# Altium schematic sheet Sunfish_ECU_BulkCaps_RevA.SchDoc
size A4
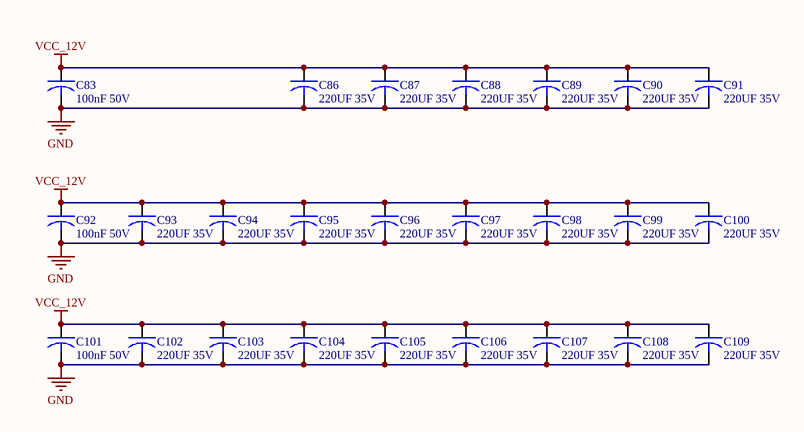
[diagram p0: Sunfish_ECU_BulkCaps_RevA.SchDoc]

## Parts
C83  100nF 50V  [0603]
C86  220UF 35V  [RB.15/.32]
C87  220UF 35V  [RB.15/.32]
C88  220UF 35V  [RB.15/.32]
C89  220UF 35V  [RB.15/.32]
C90  220UF 35V  [RB.15/.32]
C91  220UF 35V  [RB.15/.32]
C92  100nF 50V  [0603]
C93  220UF 35V  [RB.15/.32]
C94  220UF 35V  [RB.15/.32]
C95  220UF 35V  [RB.15/.32]
C96  220UF 35V  [RB.15/.32]
C97  220UF 35V  [RB.15/.32]
C98  220UF 35V  [RB.15/.32]
C99  220UF 35V  [RB.15/.32]
C100  220UF 35V  [RB.15/.32]
C101  100nF 50V  [0603]
C102  220UF 35V  [RB.15/.32]
C103  220UF 35V  [RB.15/.32]
C104  220UF 35V  [RB.15/.32]
C105  220UF 35V  [RB.15/.32]
C106  220UF 35V  [RB.15/.32]
C107  220UF 35V  [RB.15/.32]
C108  220UF 35V  [RB.15/.32]
C109  220UF 35V  [RB.15/.32]

## Nets
GND: C83.2 C86.2 C87.2 C88.2 C89.2 C90.2 C91.2 C92.2 C93.2 C94.2 C95.2 C96.2 C97.2 C98.2 C99.2 C100.2 C101.2 C102.2 C103.2 C104.2 C105.2 C106.2 C107.2 C108.2 C109.2
VCC_12V: C83.1 C86.1 C87.1 C88.1 C89.1 C90.1 C91.1 C92.1 C93.1 C94.1 C95.1 C96.1 C97.1 C98.1 C99.1 C100.1 C101.1 C102.1 C103.1 C104.1 C105.1 C106.1 C107.1 C108.1 C109.1

## Library data of the parts
C83 C92 C101 = CAP_100NF_50V_10%_0603: CAP CER 100nF 50V 10% X7R 0603; Manufacturer: Murata; Manufacturer P/N: GRM188R71H104KA93D
C86-C91 C93-C100 C102-C109 = CAP_220UF_35V_20%: CAP CER 220UF 35V 20%; Manufacturer: Kemet; Manufacturer P/N: ESK227M035AH1AA